# EAGLE schematic Wifili (EAGLE 7.1.0)
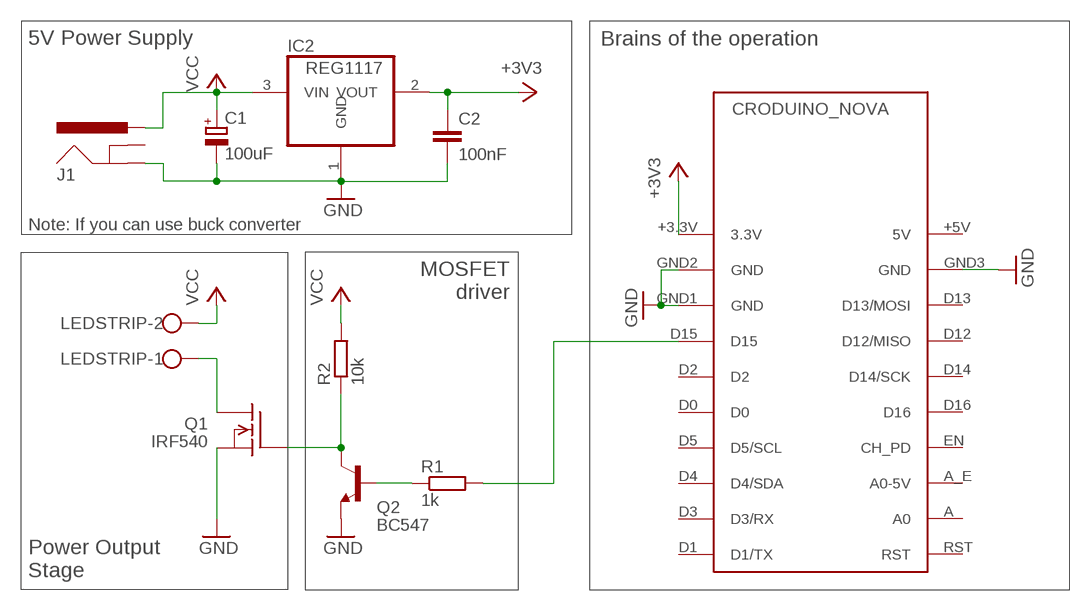
[diagram p0: schematic, sheet 1]

## Parts
C1  100uF  CPOL-EUE2.5-6  [E2,5-6]
C2  100nF  C-EU025-040X050  [C025-040X050]
CRODUINO_NOVA  NOVA  [NOVA]
IC2  REG1117  [SOT223]
J1  POWER_JACKPTH  [POWER_JACK_PTH]
LEDSTRIP  W237-102  [W237-102]
Q1  IRF540  [TO220]
Q2  BC547  [TO92]
R1  1k  R-EU_0204/7  [0204/7]
R2  10k  R-EU_0204/7  [0204/7]

## Nets
+3V3: C2.1 CRODUINO_NOVA.+3.3V(3.3V) IC2.2(VOUT)
GND: C1.- C2.2 CRODUINO_NOVA.GND1(GND) CRODUINO_NOVA.GND2(GND) CRODUINO_NOVA.GND3(GND) IC2.1(GND) J1.GND Q1.3(S) Q2.1(E)
LEDSTRIP-: LEDSTRIP.1 Q1.2(D)
N$1: Q1.1(G) Q2.3(C) R2.1
N$2: CRODUINO_NOVA.D15 R1.2
N$3: Q2.2(B) R1.1
VCC: C1.+ J1.PWR LEDSTRIP.2 R2.2
Unconnected: CRODUINO_NOVA.A(A0) CRODUINO_NOVA.A_E(A0-5V) CRODUINO_NOVA.D0 CRODUINO_NOVA.D1(D1/TX) CRODUINO_NOVA.D2 CRODUINO_NOVA.D3(D3/RX) CRODUINO_NOVA.D4(D4/SDA) CRODUINO_NOVA.D5(D5/SCL) CRODUINO_NOVA.D12(D12/MISO) CRODUINO_NOVA.D13(D13/MOSI) CRODUINO_NOVA.D14(D14/SCK) CRODUINO_NOVA.D16 CRODUINO_NOVA.EN(CH_PD) CRODUINO_NOVA.RST IC2.3(VIN) J1.GNDBREAK

## Notes on the sheet
- 5V Power Supply
- Brains of the operation
- Note: If you can use buck converter
- MOSFET
  driver
- Power Output
  Stage

## Power pins joined to a net without a drawn wire
5V: CRODUINO_NOVA.+5V(5V)

## Library data of the parts
C1 = rcl:CPOL-EU: POLARIZED CAPACITOR, European symbol
C2 = rcl:C-EU: CAPACITOR, European symbol
CRODUINO_NOVA = CroDuino:NOVA: CROduino NOVA An e-radionica's ESP8266 Arduino-compatible IoT development board.
IC2 = burr-brown:REG1117: 800mA and 1A Low Dropout (LDO) Positive Regulator 1.8V, 2.5V, 2.85V, 3.3V, 5V, and Adj; MPN: REG1117; OC_FARNELL: 1097566; OC_NEWARK: 14P6981
J1 = SparkFun-Connectors:POWER_JACK: Power Jack This is the standard 5.5mm barrel jack for power. The PTH is the most common, proven, reliable, footprint. The Slot footprint only works if the mill layer is transmitted to the PCB fab house so be warned. Mating wall wart : TOL-00298 (and others); PROD_ID: CONN-08197
LEDSTRIP = con-wago-500:W237-102: WAGO SCREW CLAMP; MPN: 237-102; OC_FARNELL: unknown; OC_NEWARK: 70K9898
Q1 = transistor-fet:IRF540: N-Channel Enhancement MOSFET (HEXFET); 100V; 28A; 0,077Ohm
Q2 = transistor:BC547: NPN TRANSISTOR
R1 R2 = rcl:R-EU_: RESISTOR, European symbol